# Altium schematic sheet Connectors.SchDoc
size A4; SheetNumber: 1; SheetTotal: 3
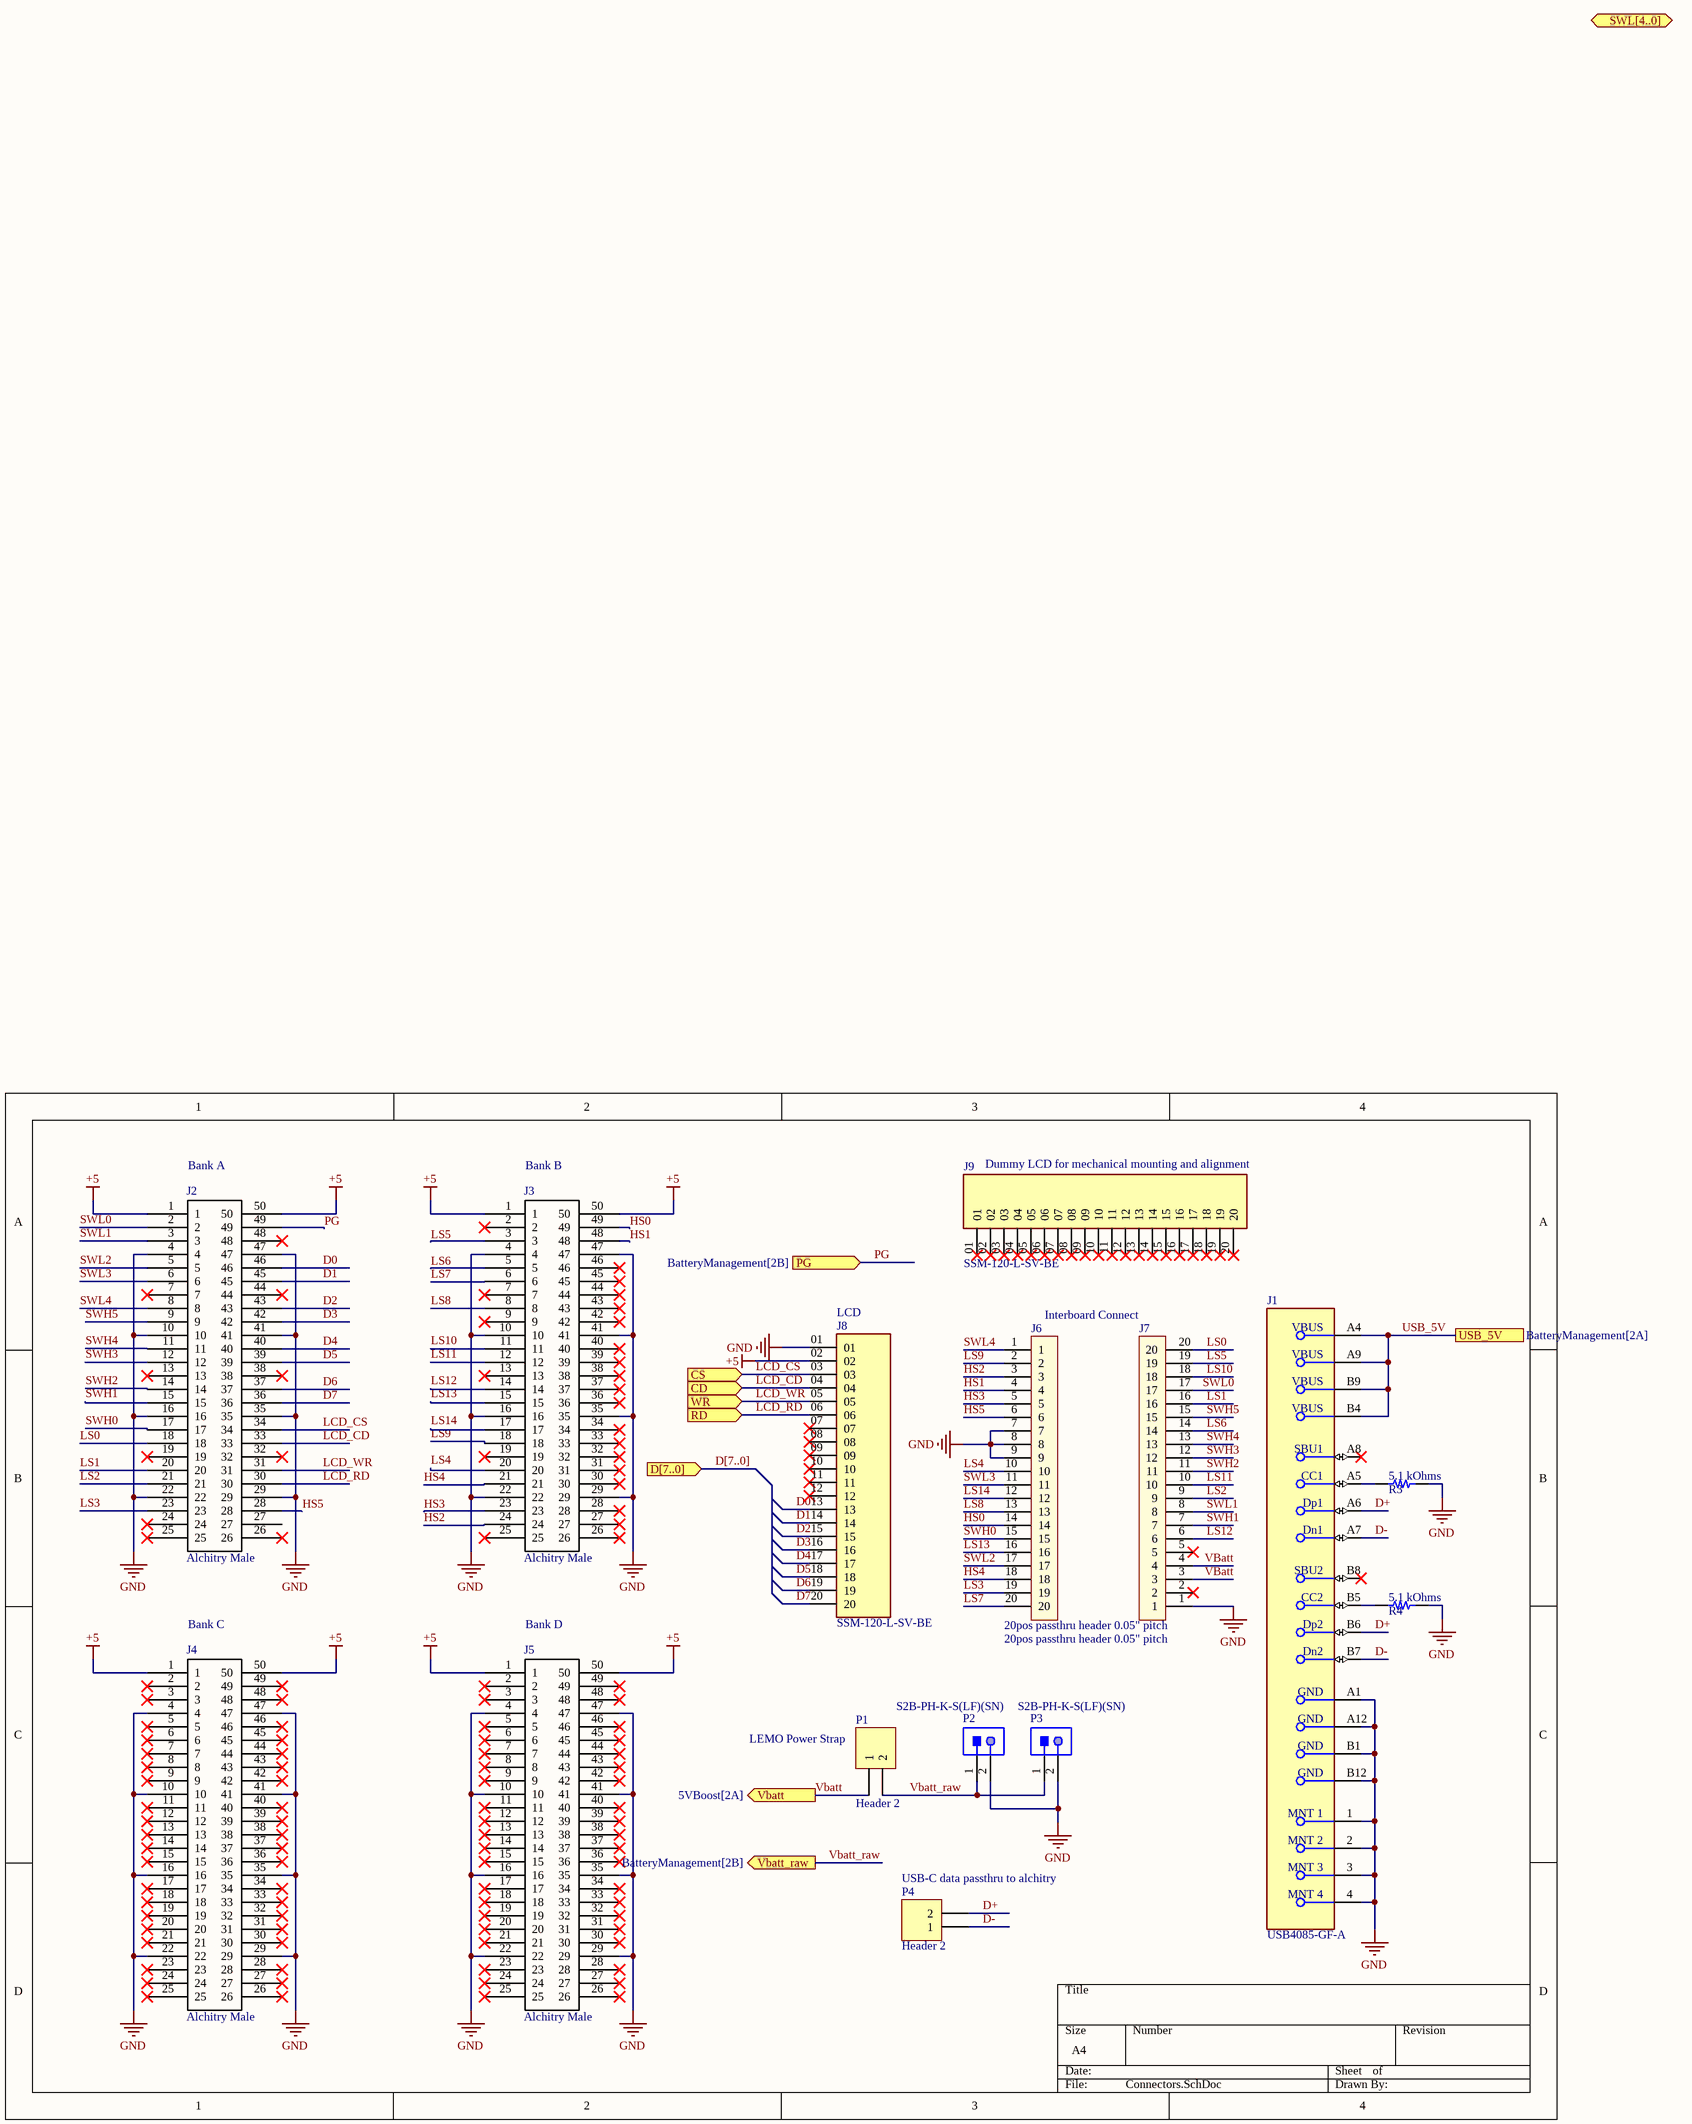
[diagram p0: Connectors.SchDoc]

## Parts
J1  USB4085-GF-A  [FP-USB4085-GF-A-MFG]
J2  Alchitry Male  [AlchitryMale]
J3  Alchitry Male  [AlchitryMale]
J4  Alchitry Male  [AlchitryMale]
J5  Alchitry Male  [AlchitryMale]
J6  20pos passthru header 0.05" pitch  [M50-3132045]
J7  20pos passthru header 0.05" pitch  [M50-3132045]
J8  SSM-120-L-SV-BE  [SAMTEC_SSM-120-L-SV-BE]
J9  SSM-120-L-SV-BE  [SAMTEC_SSM-120-L-SV-BE]
P1  Header 2  [HDR1X2]
P2  S2B-PH-K-S(LF)(SN)  [JST-S2B-PH-K-S_V]
P3  S2B-PH-K-S(LF)(SN)  [JST-S2B-PH-K-S_V]
P4  Header 2  [HDR1X2]
R3  5.1 kOhms  [RES 0805_2012]
R4  5.1 kOhms  [RES 0805_2012]

## Ports
CD (in), CS (in), D[7..0] (in), PG (in, see BatteryManagement[2B]), RD (in), SWL[4..0] (bidir), USB_5V (see BatteryManagement[2A]), Vbatt (out, see 5VBoost[2A]), Vbatt_raw (out, see BatteryManagement[2B]), WR (in)

## Nets
+5: J2.1 J2.50 J3.1 J3.50 J4.1 J4.50 J5.1 J5.50 J8.02
GND: J1.1(MNT_1) J1.2(MNT_2) J1.3(MNT_3) J1.4(MNT_4) J1.A1(GND) J1.A12(GND) J1.B1(GND) J1.B12(GND) J2.4 J2.10 J2.16 J2.22 J2.29 J2.35 J2.41 J2.47 J3.4 J3.10 J3.16 J3.22 J3.29 J3.35 J3.41 J3.47 J4.4 J4.10 J4.16 J4.22 J4.29 J4.35 J4.41 J4.47 J5.4 J5.10 J5.16 J5.22 J5.29 J5.35 J5.41 J5.47 J6.7 J6.8 J6.9 J7.1 J8.01 P2.2 P3.2 R3.2 R4.2
D0: J2.46 J8.13
D1: J2.45 J8.14
D2: J2.43 J8.15
D3: J2.42 J8.16
D4: J2.40 J8.17
D5: J2.39 J8.18
D6: J2.37 J8.19
D7: J2.36 J8.20
D+: J1.A6(Dp1) J1.B6(Dp2) P4.2
D-: J1.A7(Dn1) J1.B7(Dn2) P4.1
HS0: J3.49 J6.14
HS1: J3.48 J6.4
HS2: J3.24 J6.3
HS3: J3.23 J6.5
HS4: J3.21 J6.18
HS5: J2.28 J6.6
LCD_CD: J2.33 J8.04 ; port CD
LCD_CS: J2.34 J8.03 ; port CS
LCD_RD: J2.30 J8.06 ; port RD
LCD_WR: J2.31 J8.05 ; port WR
LS0: J2.18 J7.20
LS1: J2.20 J7.16
LS2: J2.21 J7.9
LS3: J2.23 J6.19
LS4: J3.20 J6.10
LS5: J3.3 J7.19
LS6: J3.5 J7.14
LS7: J3.6 J6.20
LS8: J3.8 J6.13
LS9: J3.18 J6.2
LS10: J3.11 J7.18
LS11: J3.12 J7.10
LS12: J3.14 J7.6
LS13: J3.15 J6.16
LS14: J3.17 J6.12
PG: J2.49 ; port PG
SWH0: J2.17 J6.15
SWH1: J2.15 J7.7
SWH2: J2.14 J7.11
SWH3: J2.12 J7.12
SWH4: J2.11 J7.13
SWH5: J2.9 J7.15
SWL0: J2.2 J7.17
SWL1: J2.3 J7.8
SWL2: J2.5 J6.17
SWL3: J2.6 J6.11
SWL4: J2.8 J6.1
USB_5V: J1.A4(VBUS) J1.A9(VBUS) J1.B4(VBUS) J1.B9(VBUS) ; port USB_5V
Vbatt: J7.3 J7.4 P1.1 ; port Vbatt
Vbatt_raw: P1.2 P2.1 P3.1 ; port Vbatt_raw
NetJ1_A5: J1.A5(CC1) R3.1
NetJ1_B5: J1.B5(CC2) R4.1

Not connected (* = marked no-connect by the designer): J1 A8(SBU1)* B8(SBU2)*; J2 7* 13* 19* 24* 25* 26* 27 32* 38* 44* 48*; J3 2* 7* 9* 13* 19* 25* 26* 27* 28* 30* 31* 32* 33* 34* 36* 37* 38* 39* 40* 42* 43* 44* 45* 46*; J4 2* 3* 5* 6* 7* 8* 9* 11* 12* 13* 14* 15* 17* 18* 19* 20* 21* 23* 24* 25* 26* 27* 28* 30* 31* 32* 33* 34* 36* 37* 38* 39* 40* 42* 43* 44* 45* 46* 48* 49*; J5 2* 3* 5* 6* 7* 8* 9* 11* 12* 13* 14* 15* 17* 18* 19* 20* 21* 23* 24* 25* 26* 27* 28* 30* 31* 32* 33* 34* 36* 37* 38* 39* 40* 42* 43* 44* 45* 46* 48* 49*; J7 2* 5*; J8 07* 08* 09* 10* 11* 12*; J9 01* 02* 03* 04* 05* 06* 07* 08* 09* 10* 11* 12* 13* 14* 15* 16* 17* 18* 19* 20*

## Buses and harness runs
bus D[7..0] = port D[7..0]

## Notes on the sheet
- (near J2) Bank A
- (near J3) Bank B
- Dummy LCD for mechanical mounting and alignment
- (near J8) LCD
- Interboard Connect
- (near J4) Bank C
- (near J5) Bank D
- (near P1) LEMO Power Strap
- (near P4) USB-C data passthru to alchitry

## Library data of the parts
J1 = CMP-196119-000001-2: CONN RCPT USB2.0 TYPE C 24POS RA; Gender: Receptacle; Number of Positions: 16; USB Standard: USB 2.0; Orientation: Right Angle; Contact Plating: Gold; Contact Material: Copper Alloy
J6 J7 = 20pos passthru header 0.05" pitch: M50-3132045; System: Connector
J8 J9 = SSM-120-L-SV-BE: 20 Position Receptacle, Bottom Entry Connector 0.100 (2.54mm) Surface Mount Gold; MF: Samtec; MP: SSM-120-L-SV-BE; Value: *; Purchase-URL: https://pricing.snapeda.com/search/part/SSM-120-L-SV-BE/?ref=eda; Check_prices: https://www.snapeda.com/parts/SSM-120-L-SV-BE/Samtec/view-part/2796009/?ref=eda; Package: None; Digi-Key_Part_Number: 612-SSM-120-L-SV-BE-K-TR-ND; SnapEDA_Link: https://www.snapeda.com/parts/SSM-120-L-SV-BE/Samtec/view-part/2796009/?ref=snap
P1 = CMP-002-00141-1: Header, 2-Pin; Signal Integrity: Connector; LatestRevisionDate: 17-Jul-2002; LatestRevisionNote: Re-released for DXP Platform.; Publisher: Altium Limited; Source: Miscellaneous Connectors.SchLib; Pins: 2; Design Item ID: Header 2; Component Type: Standard
P2 P3 = CMP-1755-00004-1: Male Header, Pitch 2 mm, 1 x 2 Position, Height 4.8 mm, Tail Length 3.4 mm, -25 to 85 degC, RoHS, Bulk; Case\Package: Radial; Tolerance: 20%; Capacitance: 10 uF; Voltage Rating (DC): 50 V; Packaging: Bulk; ComponentLink1URL: http://www.jst-mfg.com/product/pdf/eng/ePH.pdf; Radiation Hardening: No; Height: 11 mm; Package Quantity: 200; PackageDescription: Male Header, Pitch 2 mm, 1 x 2 Position, Height 4.8 mm, Tail Length 3.4 mm; PackageReference: S2B-PH-K-S; Diameter: 5 mm; Pins: 2; Mount: Through Hole; Max Operating Temperature: 85 degC; Min Operating Temperature: -40 degC; ComponentLink1Description: Datasheet; DatasheetVersion: Dec-12; Length: 11 mm; Lead Pitch: 2 mm; REACH SVHC: No SVHC; Voltage Rating: 50 V; RoHSCompliant: true
P4 = Header 2: Header, 2-Pin; LatestRevisionDate: 17-Jul-2002; LatestRevisionNote: Re-released for DXP Platform.; Publisher: Altium Limited
R3 R4 = RC0805JR-075K1L: RES 5.1K OHM 5% 1/8W 0805; Manufacturer: Yageo; Power (Watts): 0.125W, 1/8W; Temperature Coefficient: ±100ppm/°C; Part Number: RC0805JR-075K1L; Value: 5.1 kOhms; ComponentLink1Description: Datasheet; ComponentLink1URL: https://www.yageo.com/upload/media/product/productsearch/datasheet/rchip/PYu-RC_Group_51_RoHS_L_10.pdf; ComponentLink2Description: DigiKey Link; ComponentLink2URL: https://www.digikey.com/en/products/detail/yageo/RC0805JR-075K1L/728338; Composition: Thick Film; Device Package: 0805 (2012 Metric); Features: Moisture Resistant; Height - Seated (Max): 0.024" (0.60mm); LastUpdated: 2023-01-02 8:43:52 PM; Lifecycle Status: Active; Minimum Order: 1; Number of Terminations: 2; Operating Temperature: -55°C ~ 155°C; Package / Case: 0805 (2012 Metric); Packaging: CutTape; PartId: 41971; Part Status: Active; Price: 0.01; Resistance: 5.1 kOhms; Series: RC_L; Size / Dimension: 0.079" L x 0.049" W (2.00mm x 1.25mm); Supplier 1: DigiKey; Supplier Part Number 1: 311-5.1KARCT-ND; Supplier Device Package: 0805; Tolerance: ±5%